# EasyEDA schematic SCH_cansat2025_2025-10-27.json
TITLE: Sheet_1; REV: 1.0; Date: 2025-10-17; Sheet: 1/1; Drawn By: kamil232323232; Company: Your Company
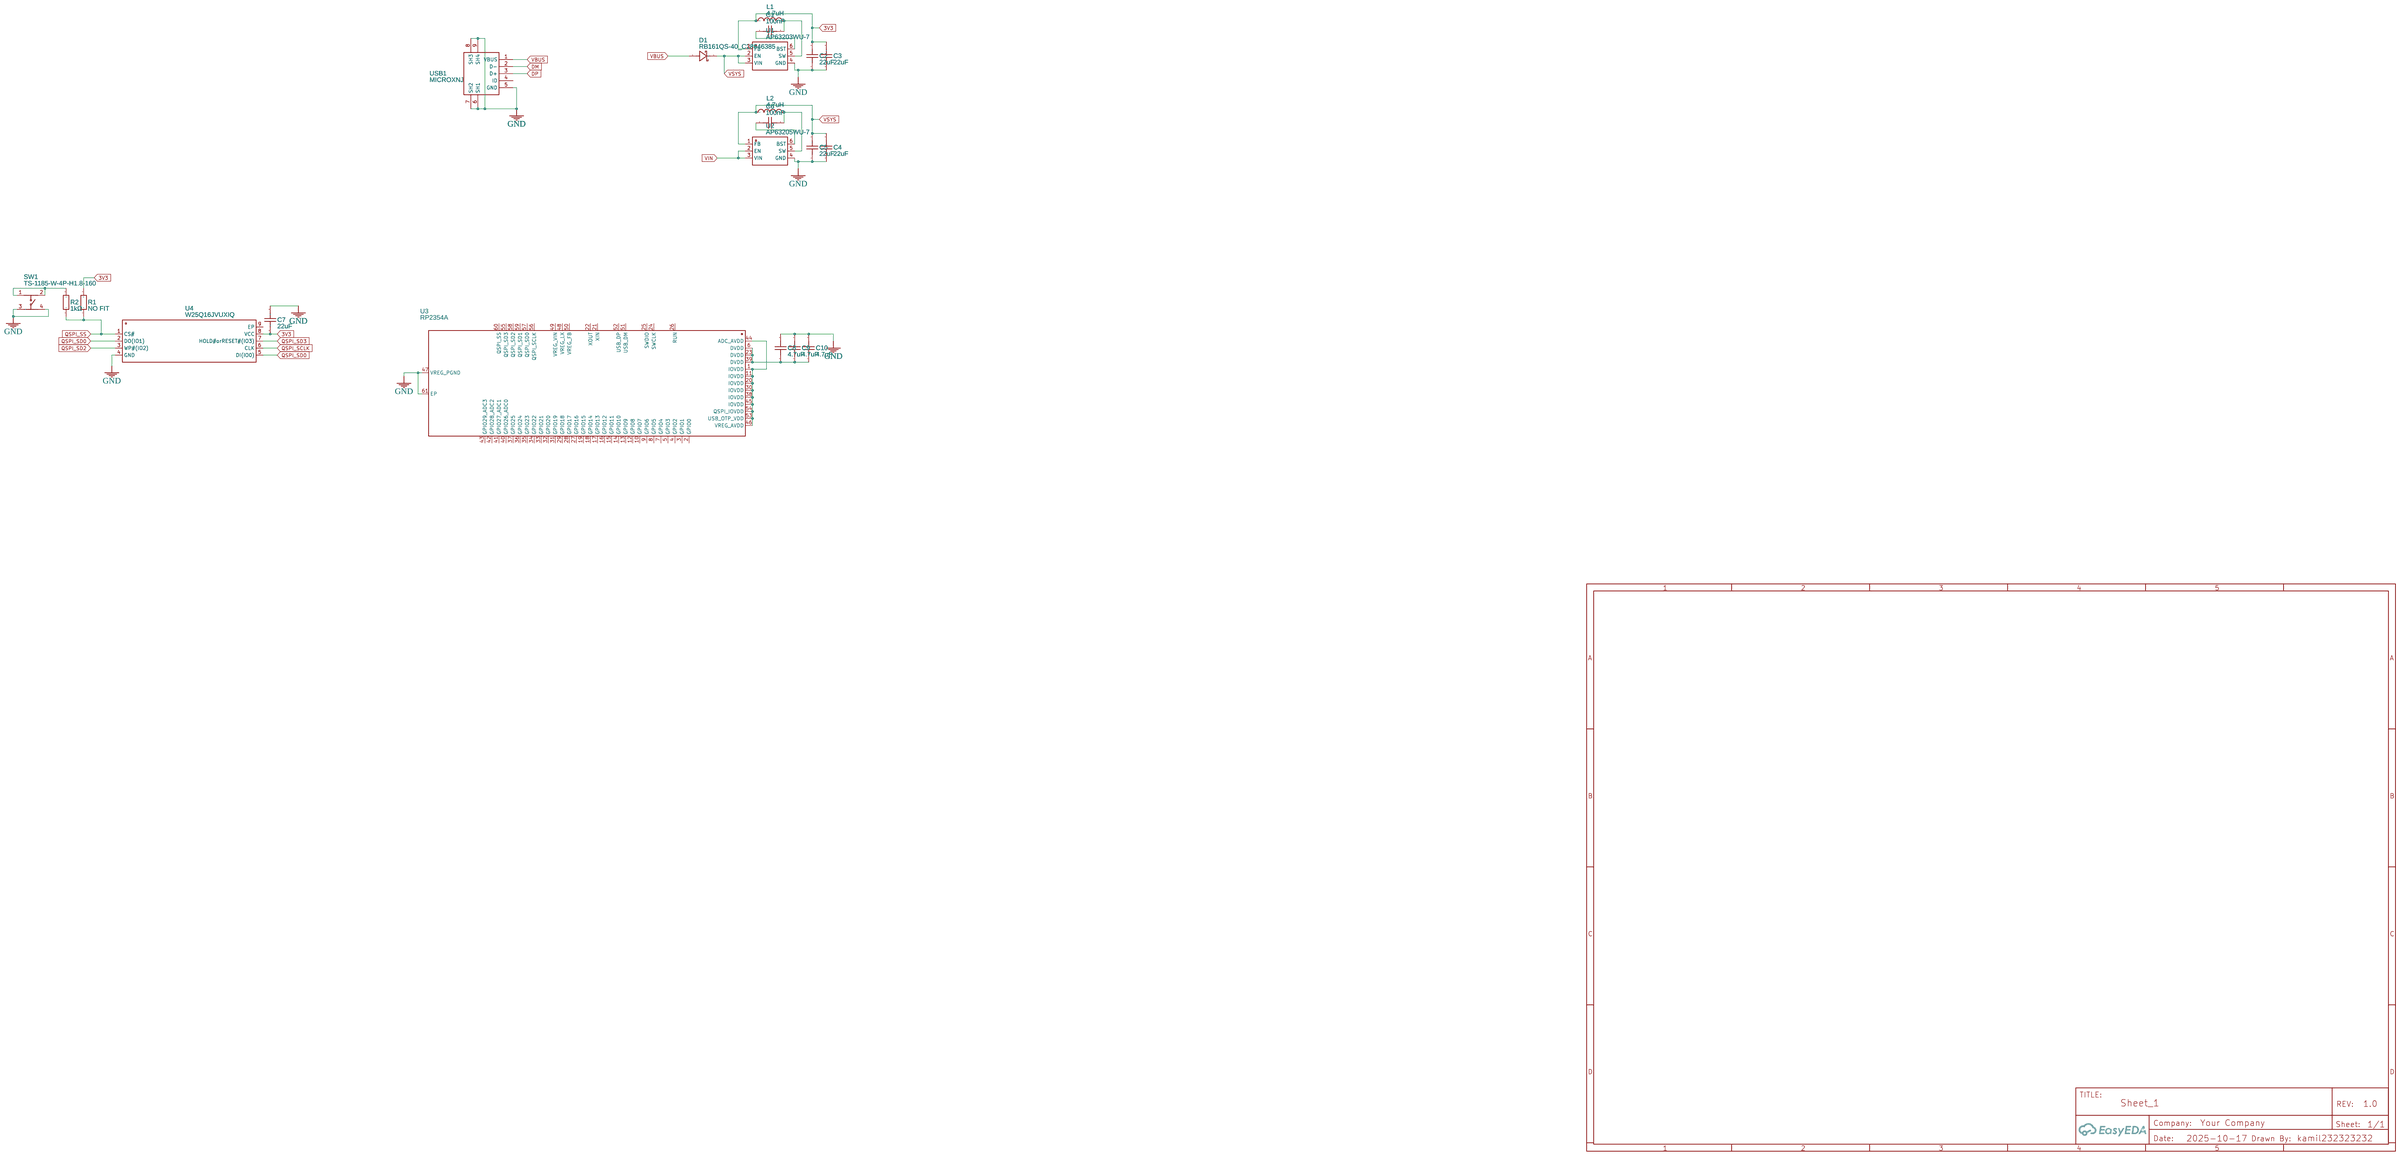
[diagram p0: schematic sheet]

## Parts
C1  100nF  [C0402]
C2  22uF  [C0402]
C3  22uF  [C0402]
C4  22uF  [C0402]
C5  22uF  [C0402]
C6  100nF  [C0402]
C7  22uF  [C0402]
C8  4.7uF  [C0402]
C9  4.7uF  [C0402]
C10  4.7uF  [C0402]
D1  RB161QS-40_C28646385  [SOD-882_L1.0-W0.6-RD]
L1  4.7uH  [L0805]
L2  4.7uH  [L0805]
R1  NO FIT  [R0402]
R2  1kΩ  [R0402]
SW1  TS-1185-W-4P-H1.8-160  [SW-SMD_4P-L3.5-W3.0-P1.50-LS4.7]
U1  AP63203WU-7  [TSOT-26_L2.9-W1.6-P0.95-LS2.8-BL]
U2  AP63205WU-7  [TSOT-23-6_L2.9-W1.6-P0.95-LS2.8-BL]
U3  RP2354A  [QFN-60_L7.0-W7.0-P0.40-TL-EP3.4]
U4  W25Q16JVUXIQ  [USON-8_L3.0-W2.0-P0.50-BL-EP]
USB1  MICROXNJ  [MICRO-USB-SMD_MICROXNJ]

## Library data of the parts
C1 C6 = FCC0402B104K160AT: Supplier: LCSC; Supplier Part: C5137468; Manufacturer: FOJAN(富捷); JLCPCB Part Class: Extended Part; Contributor: lcsc
C2-C5 C7 = GRM155R60J226ME11D: Contributor: LCSC; Supplier: LCSC; Supplier Part: C415703; Manufacturer: muRata(村田); JLCPCB Part Class: Extended Part
C8-C10 = CL05A475MP5NRNC: Supplier: LCSC; Manufacturer: SAMSUNG(三星); Supplier Part: C23733; JLCPCB Part Class: Basic Part
D1 = RB161QS-40_C28646385: Supplier: LCSC; Supplier Part: C28646385; Manufacturer: TECH PUBLIC(台舟); Manufacturer Part: RB161QS-40; JLCPCB Part Class: Extended Part; Contributor: lcsc
L1 L2 = CMI201209U4R7KT: Supplier: LCSC; Manufacturer: FH(风华); Supplier Part: C99365; JLCPCB Part Class: Extended Part
R1 = 0402WGF1002TCE: Supplier: LCSC; Manufacturer: UNI-ROYAL(厚声); Supplier Part: C25744; JLCPCB Part Class: Basic Part
R2 = 0402WGF1001TCE: Supplier: LCSC; Manufacturer: UNI-ROYAL(厚声); Supplier Part: C11702; JLCPCB Part Class: Basic Part
SW1 = TS-1185-W-4P-H1.8-160: Supplier: LCSC; Supplier Part: C51927445; Manufacturer: CAX(创都); Contributor: lcsc; JLCPCB Part Class: Extended Part
U1 = AP63203WU-7: Contributor: LCSC; Supplier: LCSC; Supplier Part: C780769; Manufacturer: DIODES(美台); JLCPCB Part Class: Extended Part
U2 = AP63205WU-7: Contributor: LCSC; Supplier: LCSC; Supplier Part: C2071056; Manufacturer: DIODES(美台); JLCPCB Part Class: Extended Part
U3 = RP2354A: Supplier: LCSC; Supplier Part: C41378174; Manufacturer: Raspberry Pi(树莓派); JLCPCB Part Class: Extended Part; Contributor: lcsc
U4 = W25Q16JVUXIQ: Contributor: lcsc; Supplier: LCSC; Supplier Part: C2843335; Manufacturer: Winbond(华邦); JLCPCB Part Class: Extended Part; link: https://lcsc.com/eda_search?q=C2843335&%26type=1&ref=editor
USB1 = MICROXNJ: Contributor: LCSC; Supplier: LCSC; Supplier Part: C404969; Manufacturer: SHOU HAN(首韩); Manufacturer Part: MicroXNJ; JLCPCB Part Class: Extended Part

## Nets
3V3: C2.2 C3.2 C7.1 L1.1 R1.2 U1.1(FB) U4.8(VCC)
GND: C2.1 C3.1 C4.1 C5.1 C7.2 C8.2 C9.2 C10.2 SW1.3 SW1.4 U1.4(GND) U2.4(GND) U3.47(VREG_PGND) U3.61(EP) U4.4(GND) USB1.5(GND) USB1.6(SH1) USB1.7(SH2) USB1.8(SH3) USB1.9(SH4)
VBUS: D1.2(A) USB1.1(VBUS)
VIN: U2.2(EN) U2.3(VIN)
DM: USB1.2(D-)
DP: USB1.3(D+)
QSPI_SCLK: U4.6(CLK)
QSPI_SD0: U4.2(DO(IO1)) U4.5(DI(IO0))
QSPI_SD2: U4.3(WP#(IO2))
QSPI_SD3: U4.7(HOLD#orRESET#(IO3))
QSPI_SS: R1.1 R2.1 U4.1(CS#)
VSYS: C4.2 C5.2 D1.1(C) L2.1 U1.2(EN) U1.3(VIN) U2.1(FB)
Net-(C1-1): C1.1 U1.6(BST)
Net-(C1-2): C1.2 L1.2 U1.5(SW)
Net-(C6-1): C6.1 U2.6(BST)
Net-(C6-2): C6.2 L2.2 U2.5(SW)
Net-(C8-1): C8.1 C9.1 C10.1 U3.6(DVDD) U3.23(DVDD) U3.39(DVDD)
Net-(R2-2): R2.2 SW1.1 SW1.2
Net-(U3-1): U3.1(IOVDD) U3.11(IOVDD) U3.20(IOVDD) U3.30(IOVDD) U3.38(IOVDD) U3.44(ADC_AVDD) U3.45(IOVDD) U3.46(VREG_AVDD) U3.53(USB_OTP_VDD) U3.54(QSPI_IOVDD)

Not connected (* = marked no-connect by the designer): U3 2(GPIO0) 3(GPIO1) 4(GPIO2) 5(GPIO3) 7(GPIO4) 8(GPIO5) 9(GPIO6) 10(GPIO7) 12(GPIO8) 13(GPIO9) 14(GPIO10) 15(GPIO11) 16(GPIO12) 17(GPIO13) 18(GPIO14) 19(GPIO15) 21(XIN) 22(XOUT) 24(SWCLK) 25(SWDIO) 26(RUN) 27(GPIO16) 28(GPIO17) 29(GPIO18) 31(GPIO19) 32(GPIO20) 33(GPIO21) 34(GPIO22) 35(GPIO23) 36(GPIO24) 37(GPIO25) 40(GPIO26_ADC0) 41(GPIO27_ADC1) 42(GPIO28_ADC2) 43(GPIO29_ADC3) 48(VREG_LX) 49(VREG_VIN) 50(VREG_FB) 51(USB_DM) 52(USB_DP) 55(QSPI_SD3) 56(QSPI_SCLK) 57(QSPI_SD0) 58(QSPI_SD2) 59(QSPI_SD1) 60(QSPI_SS); U4 9(EP); USB1 4(ID)
